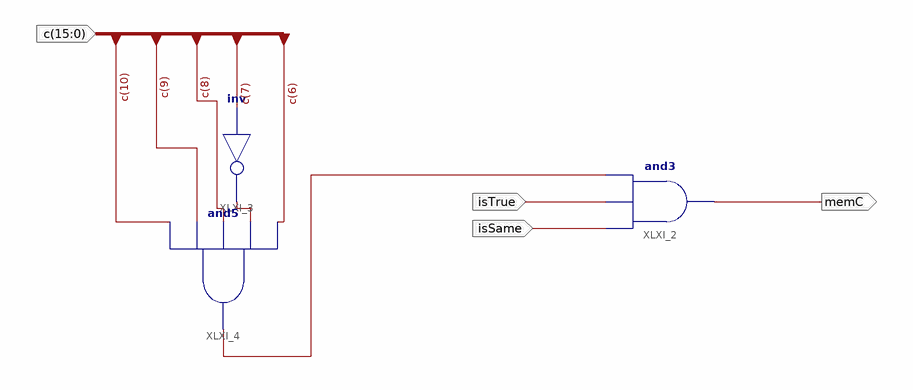
[diagram p0: schematic sheet 1]
// Xilinx ISE schematic NOP.sch (spartan3e) as structural Verilog: 3 symbols, 4 ports
module NOP (
  input  [15:0] c,
  input  isSame,
  input  isTrue,
  output memC
);

  wire XLXN_23, XLXN_24;

  and XLXI_2 (memC, isSame, isTrue, XLXN_24);
  not XLXI_3 (XLXN_23, c[7]);
  and XLXI_4 (XLXN_24, c[10], c[9], c[8], XLXN_23, c[6]);
endmodule
